# Altium project TLC5510.PrjPCB
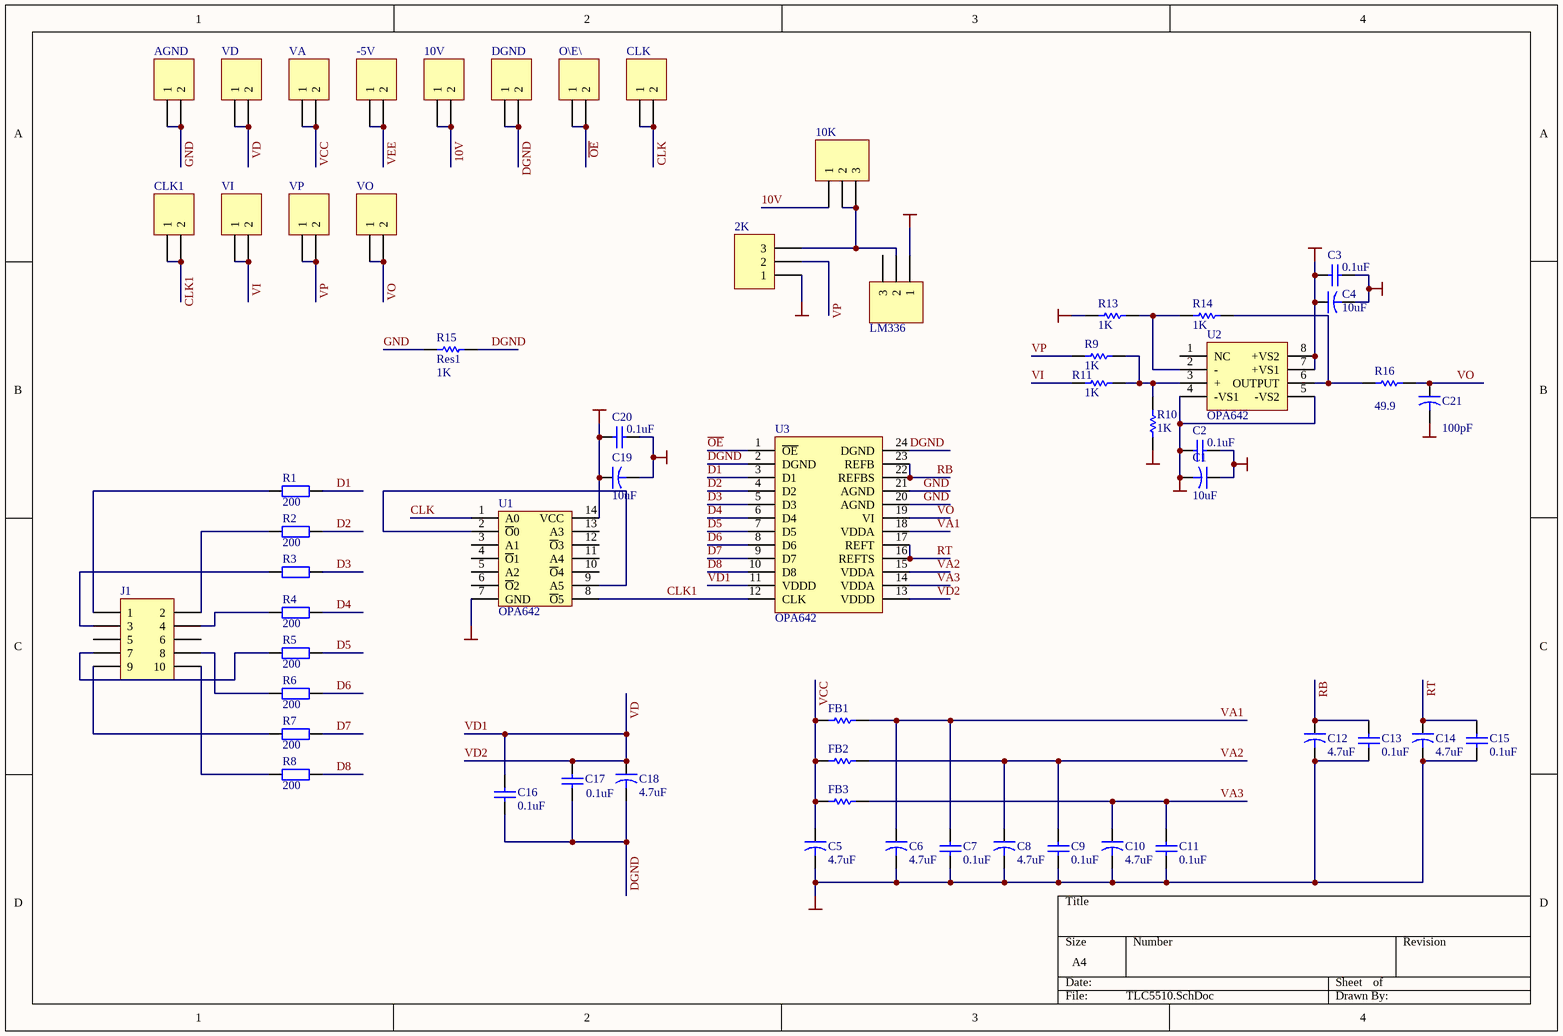
[diagram p0: TLC5510.SchDoc]
1 sheet, 58 parts. Net scope: global (net labels, ports and power ports of the same name join across sheets).
Board file: TLC5510.PcbDoc

## Sheet TLC5510.SchDoc
size A4

### Parts
2K  (no value)  [HDR1X3]
10K  (no value)  [HDR1X3]
10V  (no value)  [HDR1X2]
-5V  (no value)  [HDR1X2]
AGND  (no value)  [HDR1X2]
C1  value 10uF  [CR3225-1210]
C2  value 0.1uF  [CC2012-0805]
C3  value 0.1uF  [CC2012-0805]
C4  value 10uF  [CR3225-1210]
C5  value 4.7uF  [CR3225-1210]
C6  value 4.7uF  [CR3225-1210]
C7  value 0.1uF  [CC2012-0805]
C8  value 4.7uF  [CR3225-1210]
C9  value 0.1uF  [CC2012-0805]
C10  value 4.7uF  [CR3225-1210]
C11  value 0.1uF  [CC2012-0805]
C12  value 4.7uF  [CR3225-1210]
C13  value 0.1uF  [CC2012-0805]
C14  value 4.7uF  [CR3225-1210]
C15  value 0.1uF  [CC2012-0805]
C16  value 0.1uF  [CC2012-0805]
C17  value 0.1uF  [CC2012-0805]
C18  value 4.7uF  [CR3225-1210]
C19  value 10uF  [CR3225-1210]
C20  value 0.1uF  [CC2012-0805]
C21  value 100pF  [CR3216-1206]
CLK  (no value)  [HDR1X2]
CLK1  (no value)  [HDR1X2]
DGND  (no value)  [HDR1X2]
FB1  (no value)  [CC2012-0805]
FB2  (no value)  [CC2012-0805]
FB3  (no value)  [CC2012-0805]
J1  (no value)  [HDR2X5]
LM336  (no value)  [HDR1X3]
O\E\  (no value)  [HDR1X2]
R1  value 200  [CC2012-0805]
R2  value 200  [CC2012-0805]
R3  (no value)  [CC2012-0805]
R4  value 200  [CC2012-0805]
R5  value 200  [CC2012-0805]
R6  value 200  [CR2012-0805]
R7  value 200  [CC2012-0805]
R8  value 200  [CC2012-0805]
R9  value 1K  [AXIAL-0.3]  (hidden comment: Res1)
R10  value 1K  [AXIAL-0.3]  (hidden comment: Res1)
R11  value 1K  [AXIAL-0.3]  (hidden comment: Res1)
R13  value 1K  [AXIAL-0.3]  (hidden comment: Res1)
R14  value 1K  [AXIAL-0.3]  (hidden comment: Res1)
R15  Res1  value 1K  [CR2012-0805]
R16  value 49.9  [CC2012-0805]
U1  OPA642  [SOP-14]
U2  OPA642  [DIP-8]
U3  OPA642  [SOP-24 - duplicate3]
VA  (no value)  [HDR1X2]
VD  (no value)  [HDR1X2]
VI  (no value)  [HDR1X2]
VO  (no value)  [HDR1X2]
VP  (no value)  [HDR1X2]

### Nets
GND: 2K.1 AGND.1 AGND.2 C1.1 C2.2 C3.2 C4.2 C5.2 C6.2 C7.1 C8.2 C9.1 C10.2 C11.1 C12.2 C13.1 C14.2 C15.1 C19.2 C20.1 C21.2 LM336.1 R10.1 R13.1 R15.1 U1.7(GND) U3.20(AGND) U3.21(AGND)
VCC: C3.1 C4.1 C5.1 C19.1 C20.2 FB1.2 FB2.2 FB3.2 U1.14(VCC) U2.7(+VS1) U2.8(+VS2) VA.1 VA.2
VEE: -5V.1 -5V.2 C1.2 C2.1 U2.4(-VS1) U2.5(-VS2)
10V: 10K.1 10V.1 10V.2
CLK: CLK.1 CLK.2 U1.1(A0)
CLK1: CLK1.1 CLK1.2 U1.8(~{O}5) U3.12(CLK)
D1: R1.2 U3.3(D1)
D2: R2.2 U3.4(D2)
D3: R3.2 U3.5(D3)
D4: R4.2 U3.6(D4)
D5: R5.2 U3.7(D5)
D6: R6.2 U3.8(D6)
D7: R7.2 U3.9(D7)
D8: R8.2 U3.10(D8)
DGND: C16.1 C17.1 C18.2 DGND.1 DGND.2 R15.2 U3.2(DGND) U3.24(DGND)
~{OE}: O\E\.1 O\E\.2 U3.1(~{OE})
RB: C12.1 C13.2 U3.22(REFBS) U3.23(REFB)
RT: C14.1 C15.2 U3.16(REFTS) U3.17(REFT)
VA1: C6.1 C7.2 FB1.1 U3.18(VDDA)
VA2: C8.1 C9.2 FB2.1 U3.15(VDDA)
VA3: C10.1 C11.2 FB3.1 U3.14(VDDA)
VD: C16.2 C17.2 C18.1 U3.11(VDDD) U3.13(VDDD) VD.1 VD.2  [also labelled VD1, VD2]
VI: R11.1 VI.1 VI.2
VO: C21.1 R16.2 U3.19(VI) VO.1 VO.2
VP: 2K.2 R9.1 VP.1 VP.2
Net2K_3: 2K.3 10K.2 10K.3 LM336.2
NetJ1_1: J1.1 R1.1
NetJ1_2: J1.2 R2.1
NetJ1_3: J1.3 R3.1
NetJ1_4: J1.4 R4.1
NetJ1_7: J1.7 R5.1
NetJ1_8: J1.8 R6.1
NetJ1_9: J1.9 R7.1
NetJ1_10: J1.10 R8.1
NetR9_2: R9.2 R10.2 R11.2 U2.3(+)
NetR13_2: R13.2 R14.2 U2.2(-)
NetR14_1: R14.1 R16.1 U2.6(OUTPUT)
NetU1_2: U1.2(~{O}0) U1.9(A5)

Not connected (* = marked no-connect by the designer): J1 5 6; LM336 3; U1 3(A1) 4(~{O}1) 5(A2) 6(~{O}2) 10(~{O}4) 11(A4) 12(~{O}3) 13(A3); U2 1(NC)

### Library data of the parts
2K 10K LM336 = Header 3: Header, 3-Pin; LatestRevisionDate: 17-Jul-2002; LatestRevisionNote: Re-released for DXP Platform.; Publisher: Altium Limited
10V -5V AGND CLK CLK1 DGND O\E\ VA VD VI VO VP = Header 2: Header, 2-Pin; LatestRevisionDate: 17-Jul-2002; LatestRevisionNote: Re-released for DXP Platform.; Publisher: Altium Limited
C1 C4-C6 C8 C10 C12 C14 C18 C19 C21 = Cap2: Capacitor; Published: 23-Sep-2002; Publisher: Altium Limited
C2 C3 C7 C9 C11 C13 C15-C17 C20 = Cap: Capacitor; Published: 8-Jun-2000; LatestRevisionDate: 17-Jul-2002; LatestRevisionNote: Re-released for DXP Platform.; Publisher: Altium Limited
FB1-FB3 R9-R11 R13-R16 = Res1: Resistor; Published: 8-Jun-2000; LatestRevisionDate: 17-Jul-2002; LatestRevisionNote: Re-released for DXP Platform.; Publisher: Altium Limited
J1 = Header 5X2: Header, 5-Pin, Dual row; LatestRevisionDate: 17-Jul-2002; LatestRevisionNote: Re-released for DXP Platform.; Publisher: Altium Limited
R1 R2 R4-R8 = Res2: Resistor; Published: 8-Jun-2000; LatestRevisionDate: 17-Jul-2002; LatestRevisionNote: Re-released for DXP Platform.; Publisher: Altium Limited
R3 = Res2: Resistor; Value: 200; Published: 8-Jun-2000; LatestRevisionDate: 17-Jul-2002; LatestRevisionNote: Re-released for DXP Platform.; Publisher: Altium Limited
U1 = 74ACT04
U3 = TLC5510